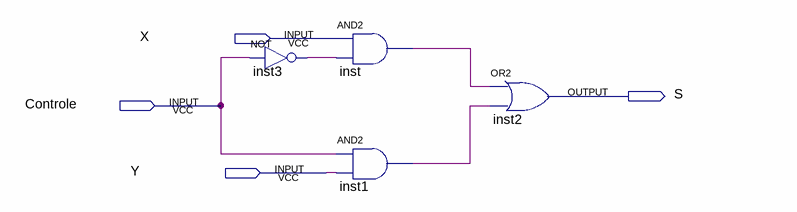
[diagram p0: schematic sheet]
// Quartus schematic Controlador2Portas.bdf as structural Verilog: 4 symbols, 4 pins
module Controlador2Portas (
  input  X,
  input  Controle,
  input  Y,
  output S
);

  wire inst1_out, inst3_out, inst_out;

  not inst3 (inst3_out, Controle);
  and inst (inst_out, X, inst3_out);
  and inst1 (inst1_out, Controle, Y);
  or inst2 (S, inst_out, inst1_out);
endmodule
